# Altium schematic sheet [6]-CH340C.SchDoc
size A4; Organization: Altium Limited; Address1: L3, 12a Rodborough Rd; Address2: Frenchs Forest; Address3: NSW; Address4: Australia 2086
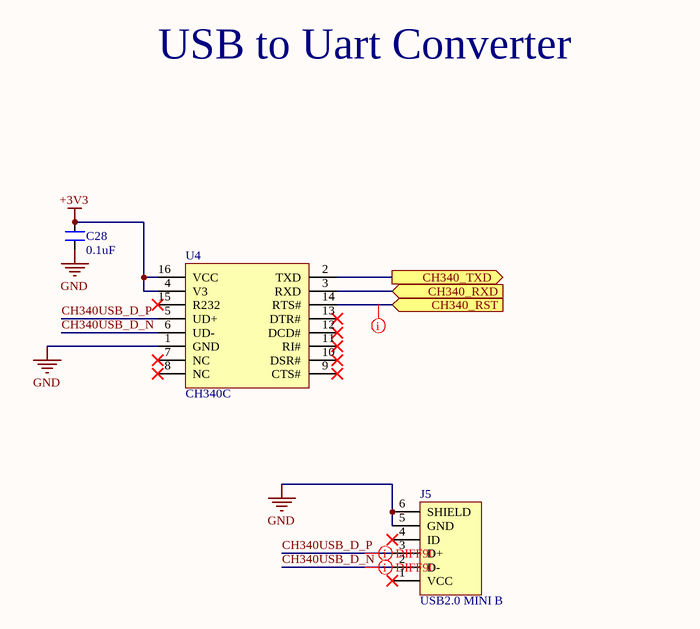
[diagram p0: [6]-CH340C.SchDoc]

## Parts
C28  0.1uF  [CAP_0805]
J5  USB2.0 MINI B  [CON_690-005-299-043]
U4  CH340C  [SOIC16_50_284_25X90_SMT]

## Ports
CH340_RST (in), CH340_RXD (in), CH340_TXD (out)

## Nets
+3V3: C28.2 U4.4(V3) U4.16(VCC)
GND: C28.1 J5.5(GND) J5.6(SHIELD) U4.1(GND)
CH340_RST: U4.14(RTS#) ; port CH340_RST
CH340_RXD: U4.3(RXD) ; port CH340_RXD
CH340_TXD: U4.2(TXD) ; port CH340_TXD
CH340USB_D_N: J5.2(D-) U4.6(UD-)
CH340USB_D_P: J5.3(D+) U4.5(UD+)

Not connected (* = marked no-connect by the designer): J5 1(VCC)* 4(ID)*; U4 7(NC)* 8(NC)* 9(CTS#)* 10(DSR#)* 11(RI#)* 12(DCD#)* 13(DTR#)* 15(R232)*

## Layout directives
differential pair; differential pair class DIFF90: CH340USB_D_N, CH340USB_D_P
mark named Critical_nets: CH340_RST

## Notes on the sheet
- USB to Uart Converter
- Title
- Size:
- Date:
- A4
- Number:
- Time:
- Revision:
- Sheet
- of
- File:

## Library data of the parts
C28 = CAP_0.1uF-50V-10%-0805: 0.1µF ±10% 50V Ceramic Capacitor X7R 0805 (2012 Metric) /; Manufacturer: Samsung; Manufacturer Part Number: CL21B104KBCNNNC; Alternate Part Number-1: NA; Case/Package: 0805; Supplier-1: SIRICOM; Supplier Part Number-1: 0805B104K500CT
J5 = CON_USB2.0-MINIB-SMD: USB - mini B USB 2.0 Receptacle Connector 5 Position Surface Mount, Right Angle; Manufacturer: EDAC; Manufacturer Part Number: 690-005-299-043; Alternate Part Number-1: NA; Case/Package: USB-MINI-B; Supplier-1: LCSC; Supplier Part Number-1: C105424
U4 = IC_CH340C: USB Bridge, USB to UART USB 2.0 UART Interface; Manufacturer: Olimex; Alternate Part Number-1: NA; Manufacturer Part Number: CH340C; Case/Package: SOIC16; Supplier-1: LCSC; Supplier Part Number-1: C84681